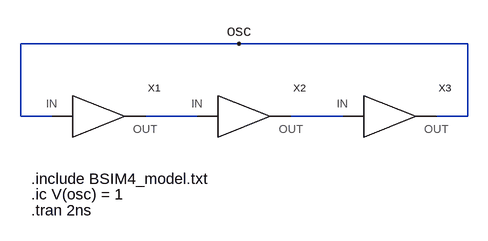
[diagram p0: schematic Draft1.asc]
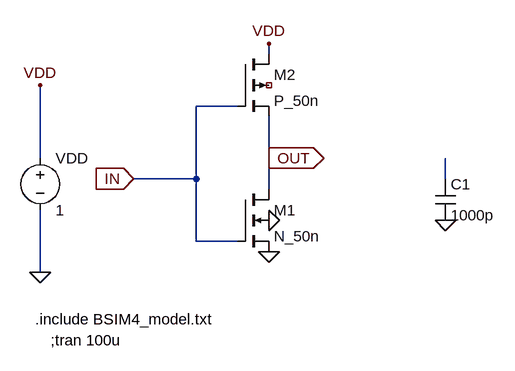
[diagram p1: sub-circuit not_cmos.asc]
Draft1.asc, the LTspice schematic file:
Version 4
SHEET 1 880 680
WIRE 208 64 -128 64
WIRE 560 64 208 64
WIRE -128 176 -128 64
WIRE -80 176 -128 176
WIRE 144 176 64 176
WIRE 368 176 288 176
WIRE 560 176 560 64
WIRE 560 176 512 176
FLAG 208 64 osc
SYMBOL NOT_CMOS 0 176 R0
SYMATTR InstName X1
SYMBOL NOT_CMOS 224 176 R0
SYMATTR InstName X2
SYMBOL NOT_CMOS 448 176 R0
SYMATTR InstName X3
TEXT -112 272 Left 2 !.include BSIM4_model.txt
TEXT -112 296 Left 2 !.ic V(osc) = 1
TEXT -112 320 Left 2 !.tran 2ns

not_cmos.asc, the sub-circuit schematic file:
Version 4
SHEET 1 880 680
WIRE 192 16 192 0
WIRE 144 96 80 96
WIRE -160 176 -160 64
WIRE 192 176 192 112
WIRE 80 208 80 96
WIRE 80 208 -16 208
WIRE 464 208 464 176
WIRE 192 224 192 176
WIRE 80 304 80 208
WIRE 144 304 80 304
WIRE -160 352 -160 256
FLAG -160 352 0
FLAG -160 64 VDD
FLAG -16 208 IN
IOPIN -16 208 In
FLAG 192 176 OUT
IOPIN 192 176 Out
FLAG 464 272 0
FLAG 192 272 0
FLAG 192 320 0
FLAG 192 0 VDD
SYMBOL nmos4 144 224 R0
SYMATTR InstName M1
SYMATTR Value N_50n
SYMATTR Value2 l=50n w=500n
SYMBOL pmos4 144 16 R0
SYMATTR InstName M2
SYMATTR Value P_50n
SYMATTR Value2 l=50n w=1u
SYMBOL voltage -160 160 R0
WINDOW 123 0 0 Left 0
WINDOW 39 0 0 Left 0
SYMATTR InstName VDD
SYMATTR Value 1
SYMBOL cap 448 208 R0
SYMATTR InstName C1
SYMATTR Value 1000p
TEXT -168 424 Left 2 !.include BSIM4_model.txt
TEXT -144 456 Left 2 !;tran 100u

The netlist it stands for:
* Draft1.asc
XX1 N001 osc not_cmos
XX2 N002 N001 not_cmos
XX3 osc N002 not_cmos

* block symbol definitions
.subckt not_cmos OUT IN
M1 OUT IN 0 0 N_50n l=50n w=500n
M2 VDD IN OUT NC_01 P_50n l=50n w=1u
VDD VDD 0 1
C1 N001 0 1000p
.include BSIM4_model.txt
;tran 100u
.ends not_cmos

.model NMOS NMOS
.model PMOS PMOS
.lib standard.mos
.include BSIM4_model.txt
.ic V(osc) = 1
.tran 2ns
.backanno
.end